# Altium schematic sheet PowerSupply.SchDoc: <Project Name>
size A3; ApprovedBy: <Appr.>; Author: <Author>; CompanyName: Infineon Technologies AG; Engineer: <Rel.>; Organization: Infineon Technologies AG; Address1: IFAG DES S PS; Address2: Am Campeon 1-12  -  85579 Neubiberg  -  Germany; Address3: 85579 Neubiberg; Address4: Germany; DocumentNumber: 4; Revision: <Rev.>; SheetNumber: 4; SheetTotal: 9; Release: RC00; PageSetup: Record=PageOptions|CenterHorizontal=True|CenterVertical=True|PrintScale=1.01|XCorrection=1.00|YCorrection=1.00|PrintKind=0|BorderSize=5000000|LeftOffset=0|BottomOffset=0|Orientation=2|PaperLength=1000|PaperWidth=1000|Scale=100|PaperSource=7|PrintQuality=-4|MediaType=1|DitherType=10|PaperKind=A3|PrintScaleMode=1; Doc_ConfidentialStatus: <Doc_ConfidentialStatus>; Doc_Preliminary: <Doc_Preliminary>
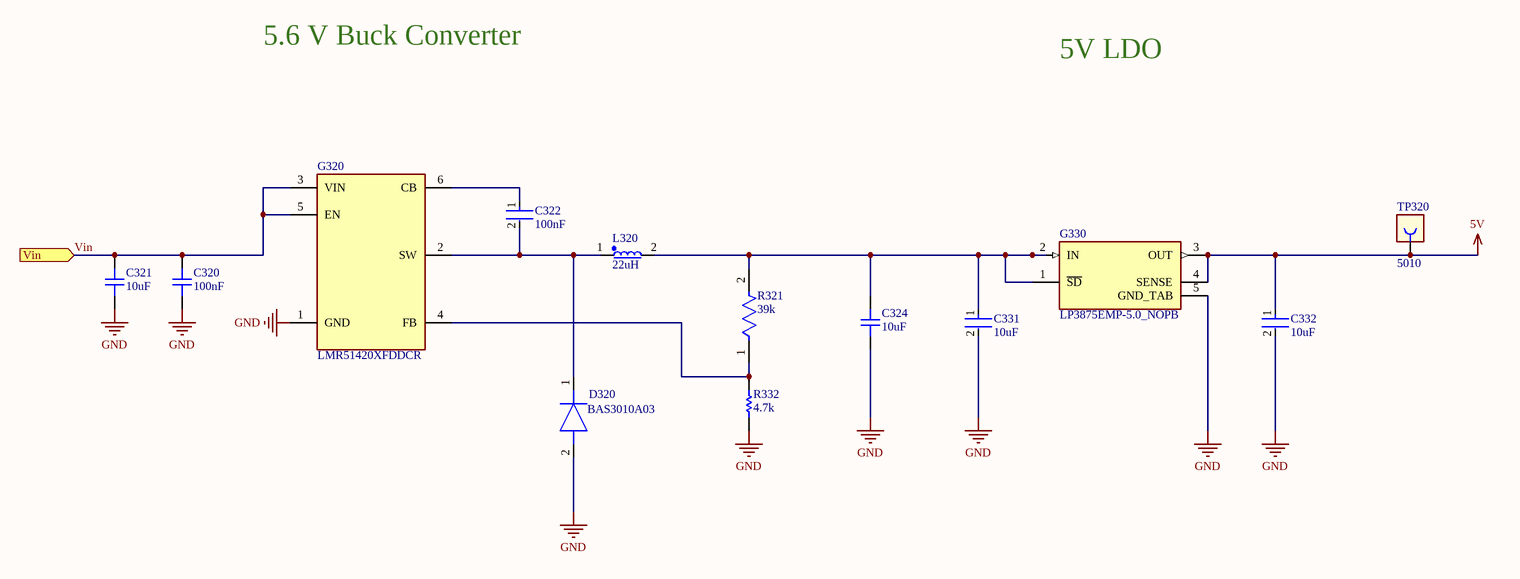
[diagram p0: PowerSupply.SchDoc]

## Parts
C320  100nF  [CAPC3216X125N-0]
C321  10uF  [CAPC3216X190N-1]
C322  100nF  [FP-1206-L_3_2_0_2-W_1_6_0-MFG]
C324  10uF  [CAPC3216X190N-1]
C331  10uF  [FP-1206-L_3_2_0_3-W_1_6_0-IPC_B]
C332  10uF  [FP-1206-L_3_2_0_3-W_1_6_0-IPC_B]
D320  BAS3010A03  [SOD2513X110N]
G320  LMR51420XFDDCR  [SOT95P280X110-6N]
G330  LP3875EMP-5.0_NOPB  [SOT150P700X180-5N]
L320  22uH  [IND-SMD-74404064220]
R321  39k  [FP-CRCW1206-e3-IPC_A]
R332  4.7k  [RESC3216X60X45ML15T20]
TP320  5010  [CON-THT-TP-5010]

## Ports
Vin (in)

## Nets
5V: C332.1 G330.3(OUT) G330.4(SENSE) TP320.1
GND: C320.1 C321.1 C324.1 C331.2 C332.2 D320.2(A) G320.1(GND) G330.5(GND_TAB) R332.1
Vin: C320.2 C321.2 G320.3(VIN) G320.5(EN) ; port Vin
NetC322_1: C322.1 G320.6(CB)
NetC322_2: C322.2 D320.1(K) G320.2(SW) L320.1
NetC324_2: C324.2 C331.1 G330.1(~{SD}) G330.2(IN) L320.2 R321.2
NetG320_4: G320.4(FB) R321.1 R332.2

## Notes on the sheet
- 5.6 V Buck Converter
- 5V LDO
- Title
- Variant
- Approved
- Date:
- Author:
- Size:
- A3
- Document Name
- Time:
- SVN Revision:
- Rel.
- Rev.
- Sheet
- of

## Library data of the parts
C320 = 282874: CAP / CERA / 100nF / 50V / 10% / X7R (EIA) / -55°C to 125°C / 1206(3216) / SMD / -; Multiple Parts: No; Legacy PartNumber: CAP01005660; Manufacturer: MuRata; Manufacturer Order Number: GRM31MR71H104KA01; Symbol Type: Capacitor; Single; Standard; 2 Pins; Alternate View: Yes; Article Number: 282874; Version Number: V01; Combined Parameters: TC:X7R (EIA);Tol.:-10%/+10%;Vdc:50V; QuickPick: 100nF / 50V / 10% / X7R (EIA) / 1206 (3216); Type: Standard; Style: Single; Package Metric: 3216; Package Imperial: 1206; ComponentStatus: Released; PLMStatus: Obsolete; Legacy DeviceID: CAP01005660; Part Type: Capacitor; Value: 100nF; Tolerance Neg: 10%; Tolerance Pos: 10%; Application: Standard; Technology: Ceramic; Temperature min: -55; Temperature max: 125; Temperature Range: Military; ROHS Compliant: Y; Automotive Qualified: No; PackageReference: 1206 (3216); ComponentLink1Description: Vendor WebSite; ComponentLink1URL: http://www.murata.com/; ComponentLink2Description: Datasheet; ComponentLink2URL: http://webnetprod.muc.infineon.com/PCBPortal_Prod/WorkFlows/AltiumComponent/StandardDocumentation?Versionid=282875; Supplier 1: Farnell; Supplier 2: DigiKey; Supplier 3: Mouser; Second Source allowed: Yes; Voltage DC (max): 50V; Package Description: Capacitor,non-polarized,Chip;3.20mm L X 1.60mm W X 1.25mm H
C321 C324 = 648992: CAP / CERA / 10uF / 50V / 20% / X5R (EIA) / -55°C to 85°C / 1206 (3216) / SMD / -; Multiple Parts: No; Manufacturer: Taiyo Yuden; Manufacturer Order Number: UMK316BBJ106ML-T; Symbol Type: Capacitor; Single; Standard; 2 Pins; Alternate View: Yes; Article Number: 648992; Version Number: V00; Combined Parameters: TC:X5R (EIA);Tol.:-20%/+20%;Vdc:50V; QuickPick: 10uF / 50V / 20% / X5R (EIA) / 1206 (3216); Type: Standard; Style: Single; ComponentStatus: Released; PLMStatus: Active; Part Type: Capacitor; Value: 10uF; Tolerance Neg: 20%; Tolerance Pos: 20%; Application: Standard; Technology: Ceramic; Temperature min: -55; Temperature max: 85; Temperature Range: Military; ROHS Compliant: Y; Automotive Qualified: No; PackageReference: 1206 (3216); ComponentLink1Description: Vendor WebSite; ComponentLink1URL: http://www.yuden.co.jp/or/product/; ComponentLink2Description: Datasheet; ComponentLink2URL: http://webnetprod.muc.infineon.com/PCBPortal_Prod/WorkFlows/AltiumComponent/StandardDocumentation?Versionid=648993; Supplier 1: Farnell; Supplier Part Number 1: 2779059; Supplier 2: DigiKey; Supplier Part Number 2: 587-3248-1-ND; Supplier 3: Mouser; Supplier Part Number 3: 963-UMK316BBJ106ML-T; Second Source allowed: Yes; Voltage DC (max): 50V; Package Description: Capacitor,non-polarized,Chip;3.20mm L X 1.60mm W X 1.90mm H
C322 = CMP-2000-05018-2: General Purpose Ceramic Capacitor, 1206, 100nF, 10%, X7R, 15%, 50V; Dissipation Factor: 2.5%; Insulation Resistance: 100GR; Dielectric: X7R; Thickness: 0.037inch; Case Code (Imperial): 1206; Case Code (Metric): 3216; Dielectric Material: Ceramic; Width: 1.6mm; Voltage Rating (DC): 50V; Termination: SMD/SMT; Tolerance: 10%; REACH SVHC: No SVHC; Height: 0.94mm; Length: 3.2mm; Voltage: 50V; Capacitance: 100nF; Packaging: Tape and Reel; Depth: 1.6mm; Voltage Rating: 50V; Series: -; Contact Plating: Tin; Mount: Surface Mount; Package Quantity: 1; Construction: Flat; Max Operating Temperature: 125°C; Min Operating Temperature: -55°C; Case/Package: 1206; Lead Free: Lead Free; RoHS Compliant: Yes; Number of Pins: 2; Radiation Hardening: No; Value: 100nF; LCSC Part #: C97928
C331 C332 = CMP-2000-07359-3: None; Voltage Rating: 50V; Tolerance: 20%; Dielectric: X5R; Package Quantity: 2000; Capacitance: 10uF; Min Operating Temperature: -55°C; Halogen Free: Halogen Free; Width: 0.063inch; Case Code (Imperial): 1206; RoHS Compliant: Yes; Packaging: Tape and Reel; Case Code (Metric): 3216; Height: 1.6mm; Construction: Flat; Length: 0.126inch; Thickness: 0.075inch; Termination: SMD/SMT; Mount: Surface Mount; Series: M; Case/Package: 1206; Voltage Rating (DC): 50V; Max Operating Temperature: 85°C; Value: 10uF
D320 = BAS3010A03WE6327HTSA1: Diode; Manufacturer_Name: Infineon; Datasheet Link: https://www.infineon.com/dgdl/Infineon-BAS3010ASERIES-DS-v01_01-en.pdf?fileId=db3a30431ddc9372011dfbc50f231c06; Height: 1.1mm; Manufacturer_Part_Number: BAS3010A03WE6327HTSA1; Mouser Part Number: 726-BAS3010A-03WE6; Mouser Price/Stock: https://www.mouser.co.uk/ProductDetail/Infineon-Technologies/BAS3010A03WE6327HTSA1?qs=K00xGehIljtEbk1%252B2pLZ%252BQ%3D%3D; Arrow Part Number: BAS3010A03WE6327HTSA1; Arrow Price/Stock: https://www.arrow.com/en/products/bas3010a03we6327htsa1/infineon-technologies-ag?region=europe; MPN: BAS3010A03WE6327HTSA1; Value: BAS3010A03WE6327HTSA1
G320 = LMR51420XFDDCR: Integrated Circuit; Manufacturer_Name: Texas Instruments; Datasheet Link: https://www.ti.com/lit/ds/symlink/lmr51420.pdf?ts=1662461097045&ref_url=https%253A%252F%252Fwww.ti.com%252Fproduct%252FLMR51420%252Fpart-details%252FLMR51420XFDDCR; Height: 1.1mm; Manufacturer_Part_Number: LMR51420XFDDCR; Mouser Part Number: 595-LMR51420XFDDCR; Mouser Price/Stock: https://www.mouser.co.uk/ProductDetail/Texas-Instruments/LMR51420XFDDCR?qs=vvQtp7zwQdMiXKT41134nA%3D%3D; Arrow Part Number: LMR51420XFDDCR; Arrow Price/Stock: https://www.arrow.com/en/products/lmr51420xfddcr/texas-instruments?utm_currency=USD&region=nac; Value: LMR51420XFDDCR; LCSC Part #: C5752071; MPN: LMR51420XFDDCR
G330 = LP3875EMP-5.0_NOPB: Integrated Circuit; Manufacturer_Name: Texas Instruments; Manufacturer_Part_Number: LP3875EMP-5.0/NOPB; Value: LP3875EMP-5.0/NOPB; Datasheet Link: http://www.ti.com/lit/ds/symlink/lp3875.pdf; Height: 1.8mm; Mouser Part Number: 926-3875EMP-5.0/NOPB; Mouser Price/Stock: https://www.mouser.co.uk/ProductDetail/Texas-Instruments/LP3875EMP-5.0-NOPB?qs=1FNqv8aZn1QHJdmRa8cUbw%3D%3D; Arrow Part Number: LP3875EMP-5.0/NOPB; Arrow Price/Stock: https://www.arrow.com/en/products/lp3875emp-5.0nopb/texas-instruments; LCSC Part #: C2860557; MPN: LP3875EMP-5.0/NOPB
L320 = 638654: IND / STD / 22uH / 2.1A / 20% / -40°C to 125°C / 89mR / SMD / Inductor; 2 pin, 6.00 mm L X 6.00 mm W X 4.50 mm H Body / SMD / -; Multiple Parts: No; Manufacturer: Wurth Elektronik; Manufacturer Order Number: 74404064220; Symbol Type: Inductor; Single; Standard; Polarized; Core; 2 Pins; Alternate View: Yes; Article Number: 638654; Version Number: V01; Combined Parameters: Tol.:-20%/+20%;Rdc:89mR;Idc:2.1A;Fres:15MHz; QuickPick: 22uH / Standard / SMD; Type: Standard; Style: Single; Automotive Qualified: AEC Q200; ComponentStatus: Released; PLMStatus: Active; Voltage DC (max): na; Part Type: Inductor; Value: 22uH; Tolerance Neg: 20%; Tolerance Pos: 20%; Application: Power Electronics; Technology: Wire Wound; Temperature min: -40; Temperature max: 125; Temperature Range: Automotive; ROHS Compliant: Y; PackageReference: SMD; ComponentLink1Description: Vendor WebSite; ComponentLink1URL: http://www.we-online.com; ComponentLink2Description: Datasheet; ComponentLink2URL: http://webnetprod.muc.infineon.com/PCBPortal_Prod/WorkFlows/AltiumComponent/StandardDocumentation?Versionid=638655; Supplier 1: Farnell; Supplier Part Number 1: 2431542; Supplier 2: DigiKey; Supplier Part Number 2: 732-5554-1-ND; Supplier 3: Mouser; Supplier Part Number 3: 710-74404064220; Second Source allowed: Yes; Package Description: Inductor; 2 pin, 6.00 mm L X 6.00 mm W X 4.50 mm H Body; LCSC Part #: C1331921; MPN: 74404064220
R321 = CMP-02407-006388-1: RES Thick Film, 39kΩ, 1%, 0.25W, 100ppm/°C, 1206; MPN: CRCW120639K0FKEA; Power Rating: 250mW; Working Voltage: 200V; Resistance: 39kR; Packaging: Tape and Reel; Features: Automotive AEC-Q200; Contact Plating: Tin; Weight: 0.000353oz; Depth: 1.6mm; Case Code (Metric): 3216; Length: 3.2mm; Number of Terminations: 2; Military Standard: Not; Temperature Coefficient: 100ppm/°C; Radiation Hardening: No; Composition: Thick Film; Termination: SMD/SMT; Voltage Rating (DC): 200V; Width: 0.063inch; Height: 0.55mm; Case/Package: 1206; Max Operating Temperature: 155°C; Max Power Dissipation: 250mW; Number of Pins: 2; Voltage Rating: 200V; Lead Free: Lead Free; Package Quantity: 10; Case Code (Imperial): 1206; Min Operating Temperature: -55°C; Tolerance: 1%; Value: 39k
R332 = CMP-2100-03618-1: Chip Resistor, 4.7 KOhm, +/- 1%, 0.25 W, -55 to 155 degC, 1206 (3216 Metric), RoHS, Tape and Reel; Manufacturer: Vishay Semiconductor; Power Rating: 250mW; Voltage Rating: 200V; Temperature Coefficient: 100ppm/degreesC; Package Quantity: 10; Composition: ThickFilm; REACH SVHC: Unknown; Mount: SurfaceMount; Max Operating Temperature: 155degC; Length: 3.2mm; Number of Terminations: 2; Case Code (Metric): 3216; Military Standard: Not; Width: 1.6mm; Datasheet Version: 41061.0; Max Power Dissipation: 250mW; Datasheet URL: http://www.vishay.com/docs/20035/dcrcwe3.pdf; Contact Plating: Tin; Case/Package: 1206; Height: 0.55mm; Package Reference: 1206.0; Lead Free: LeadFree; Weight: 0.000353oz; Package Description: 2-Pin Surface Mount Device, Body 3.15 x 1.6 mm; Min Operating Temperature: -55degC; Resistance: 4.7KOhm; Packaging: TapeandReel; Depth: 1.6mm; Tolerance: 1%; RoHSCompliant: true; Termination: SMD/SMT; Case Code (Imperial): 1206; Voltage Rating (DC): 200V; Radiation Hardening: No; Manufacturer URL: http://www.vishay.com/; Value: 4.7k; MPN: *
TP320 = 382400: PC Test Point-Multipurpose THT, Red; Multiple Parts: No; Legacy PartNumber: CON01500529; Manufacturer: Keystone Electronics Corp.; Symbol Type: Connector, 1 Lead, Female; Alternate View: Yes; Article Number: 382400; Version Number: V01; Legacy DeviceID: KEY_5010; Combined Parameters: Board-to-Cable None (onboard);1x1;Mounting:THT;Orient:0° (vertical);Shielded:No; QuickPick: 0° (vertical) / Board-to-Cable; Style: Not Applicable; ComponentStatus: Released; PLMStatus: Active; Voltage DC (max): na; Part Type: Connector; Manufacturer Order Number: 5010; Value: 5010; Type: Board-to-Cable; Application: Test; Temperature min: 0; Temperature max: 0; Temperature Range: Military; ROHS Compliant: Y; Automotive Qualified: No; ComponentLink1Description: Vendor WebSite; ComponentLink1URL: http://www.keyelco.com/; ComponentLink2Description: Datasheet; ComponentLink2URL: http://webnetprod.muc.infineon.com/PCBPortal_Prod/WorkFlows/AltiumComponent/StandardDocumentation?Versionid=382401; Supplier 1: Farnell; Supplier Part Number 1: 2301288; Supplier 2: DigiKey; Supplier Part Number 2: 36-5010-ND; Supplier 3: Mouser; Supplier Part Number 3: 534-5010; Second Source allowed: Yes; Package Description: Test Point, 1.78 mm Lead Width, Round, 3.17 mm Dia X 8.28 mm H body